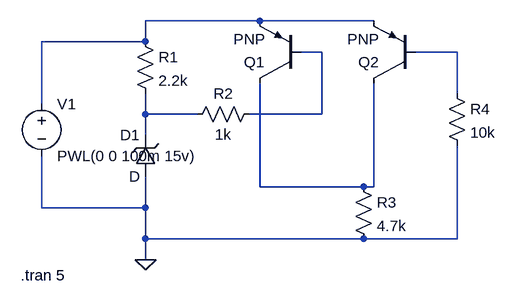
[diagram p0: schematic PNP_BJT_Overvoltage_Protection_Circuit.asc]
PNP_BJT_Overvoltage_Protection_Circuit.asc, the LTspice schematic file:
Version 4
SHEET 1 880 680
WIRE 304 -112 128 -112
WIRE 480 -112 304 -112
WIRE 128 -80 128 -112
WIRE 128 -80 -32 -80
WIRE 400 -64 368 -64
WIRE 608 -64 544 -64
WIRE 608 0 608 -64
WIRE -32 16 -32 -80
WIRE 128 32 128 0
WIRE 208 32 128 32
WIRE 400 32 400 -64
WIRE 400 32 288 32
WIRE 128 64 128 32
WIRE 304 144 304 -16
WIRE 464 144 304 144
WIRE 480 144 480 -16
WIRE 480 144 464 144
WIRE -32 176 -32 96
WIRE 128 176 128 128
WIRE 128 176 -32 176
WIRE 128 224 128 176
WIRE 464 224 128 224
WIRE 608 224 608 80
WIRE 608 224 464 224
WIRE 128 256 128 224
FLAG 128 256 0
SYMBOL voltage -32 0 R0
WINDOW 123 0 0 Left 0
WINDOW 39 0 0 Left 0
SYMATTR InstName V1
SYMATTR Value PWL(0 0 100m 15v)
SYMBOL res 112 -96 R0
SYMATTR InstName R1
SYMATTR Value 2.2k
SYMBOL zener 144 128 R180
WINDOW 0 24 64 Left 2
WINDOW 3 24 0 Left 2
SYMATTR InstName D1
SYMBOL res 304 16 R90
WINDOW 0 0 56 VBottom 2
WINDOW 3 32 56 VTop 2
SYMATTR InstName R2
SYMATTR Value 1k
SYMBOL pnp 368 -16 R180
SYMATTR InstName Q1
SYMBOL res 448 128 R0
SYMATTR InstName R3
SYMATTR Value 4.7k
SYMBOL pnp 544 -16 R180
SYMATTR InstName Q2
SYMBOL res 592 -16 R0
SYMATTR InstName R4
SYMATTR Value 10k
TEXT -64 280 Left 2 !.tran 5

The netlist it stands for:
* PNP_BJT_Overvoltage_Protection_Circuit.asc
V1 N001 0 PWL(0 0 100m 15v)
R1 N001 N004 2.2k
D1 0 N004 D
R2 N002 N004 1k
Q1 N005 N002 N001 0 PNP
R3 N005 0 4.7k
Q2 N005 N003 N001 0 PNP
R4 N003 0 10k
.model D D
.lib standard.dio
.model NPN NPN
.model PNP PNP
.lib standard.bjt
.tran 5
.backanno
.end